# Altium schematic sheet TDigitalClock.schDoc
size A3
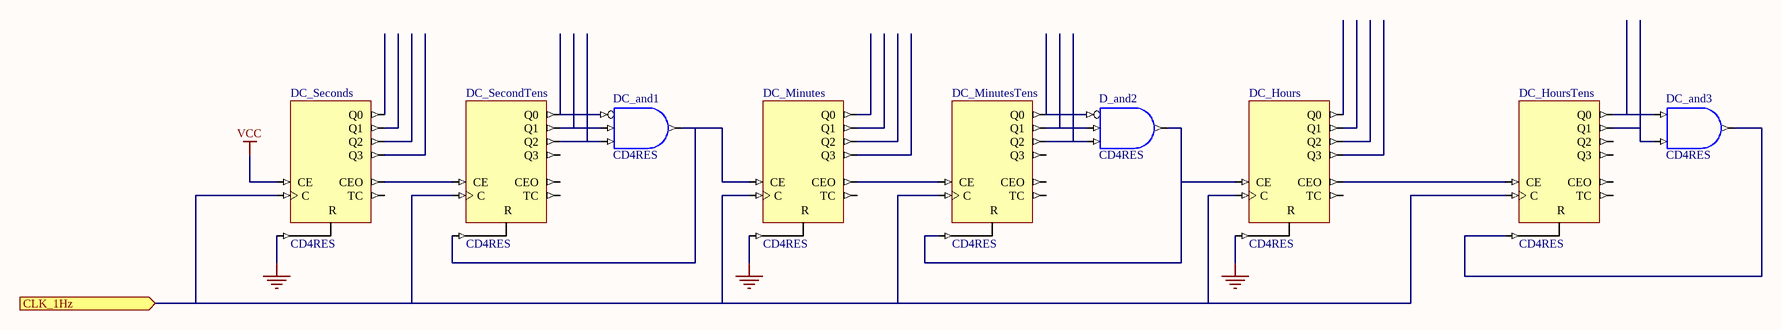
[diagram p0: TDigitalClock.schDoc]

## Parts
D_and2  CD4RES
DC_and1  CD4RES
DC_and3  CD4RES
DC_Hours  CD4RES
DC_HoursTens  CD4RES
DC_Minutes  CD4RES
DC_MinutesTens  CD4RES
DC_Seconds  CD4RES
DC_SecondTens  CD4RES

## Ports
CLK_1Hz (in)

## Nets
GND: DC_Hours.R DC_Minutes.R DC_Seconds.R
VCC: DC_Seconds.CE
CLK_1Hz: DC_Hours.C DC_HoursTens.C DC_Minutes.C DC_MinutesTens.C DC_Seconds.C DC_SecondTens.C ; port CLK_1Hz
NetD_and2_I0: D_and2.I0 DC_MinutesTens.Q0
NetD_and2_I1: D_and2.I1 DC_MinutesTens.Q1
NetD_and2_I2: D_and2.I2 DC_MinutesTens.Q2
NetD_and2_O: D_and2.O DC_Hours.CE DC_MinutesTens.R
NetDC_and1_I0: DC_and1.I0 DC_SecondTens.Q0
NetDC_and1_I1: DC_and1.I1 DC_SecondTens.Q1
NetDC_and1_I2: DC_and1.I2 DC_SecondTens.Q2
NetDC_and1_O: DC_and1.O DC_Minutes.CE DC_SecondTens.R
NetDC_and3_I0: DC_and3.I0 DC_HoursTens.Q0
NetDC_and3_I1: DC_and3.I1 DC_HoursTens.Q1
NetDC_and3_O: DC_and3.O DC_HoursTens.R
NetDC_Hours_CEO: DC_Hours.CEO DC_HoursTens.CE
NetDC_Minutes_CEO: DC_Minutes.CEO DC_MinutesTens.CE
NetDC_Seconds_CEO: DC_Seconds.CEO DC_SecondTens.CE

Not connected (* = marked no-connect by the designer): DC_Hours Q0 Q1 Q2 Q3 TC; DC_HoursTens CEO Q2 Q3 TC; DC_Minutes Q0 Q1 Q2 Q3 TC; DC_MinutesTens CEO Q3 TC; DC_Seconds Q0 Q1 Q2 Q3 TC; DC_SecondTens CEO Q3 TC

## Library data of the parts
D_and2 DC_and1 = AND3B1: 3-Input AND Gate with Active Low A Input, Single Pin Version; ArchiveName: GENERIC; Published: 9-30-2003; Publisher: Altium Limited; Xilinx Equivalent: AND3B1; Core Revision: 1.00.00
DC_and3 = AND2S: 2-Input AND Gate, Single Pin Version; Xilinx Equivalent: AND2; ArchiveName: GENERIC; Published: 9-30-2003; Publisher: Altium Limited; Core Revision: 1.00.00
DC_Hours DC_HoursTens DC_Minutes DC_MinutesTens DC_Seconds DC_SecondTens = CD4RES: 4-Bit Cascadable BCD Counter with Clock Enable and Synchronous Reset, Single Pin Version; Xilinx Equivalent: CD4RE; ArchiveName: GENERIC; Published: 9-30-2003; Publisher: Altium Limited; Core Revision: 1.00.00